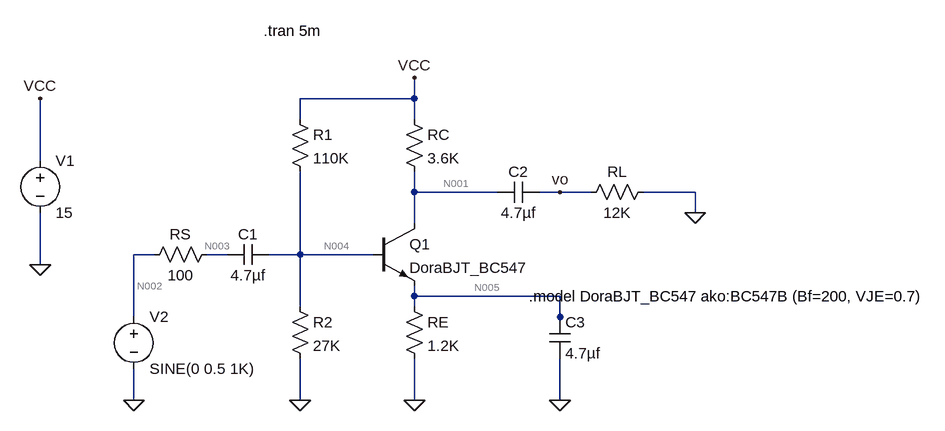
[diagram p0: schematic exp51a.asc]
exp51a.asc, the LTspice schematic file:
Version 4
SHEET 1 880 680
WIRE 32 -160 32 -192
WIRE 32 -160 -144 -160
WIRE -144 -128 -144 -160
WIRE 32 -128 32 -160
WIRE -544 -64 -544 -160
WIRE 32 -16 32 -48
WIRE 160 -16 32 -16
WIRE 256 -16 224 -16
WIRE 304 -16 256 -16
WIRE 464 -16 384 -16
WIRE 464 16 464 -16
WIRE 32 32 32 -16
WIRE -368 80 -400 80
WIRE -256 80 -288 80
WIRE -144 80 -144 -48
WIRE -144 80 -192 80
WIRE -32 80 -144 80
WIRE -544 96 -544 16
WIRE 32 144 32 128
WIRE 256 144 32 144
WIRE -144 160 -144 80
WIRE 32 160 32 144
WIRE -400 176 -400 80
WIRE 256 176 256 144
WIRE 256 192 256 176
WIRE -400 304 -400 256
WIRE -144 304 -144 240
WIRE 32 304 32 240
WIRE 256 304 256 240
FLAG -544 96 0
FLAG -544 -160 VCC
FLAG 32 -192 VCC
FLAG -144 304 0
FLAG 32 304 0
FLAG 464 16 0
FLAG -400 304 0
FLAG 256 -16 vo
FLAG 256 304 0
SYMBOL npn -32 32 R0
SYMATTR InstName Q1
SYMATTR Value DoraBJT_BC547
SYMBOL res 16 -144 R0
SYMATTR InstName RC
SYMATTR Value 3.6K
SYMBOL voltage -544 -80 R0
SYMATTR InstName V1
SYMATTR Value 15
SYMBOL res -160 -144 R0
SYMATTR InstName R1
SYMATTR Value 110K
SYMBOL res 16 144 R0
SYMATTR InstName RE
SYMATTR Value 1.2K
SYMBOL res -160 144 R0
SYMATTR InstName R2
SYMATTR Value 27K
SYMBOL res -272 64 R90
WINDOW 0 0 56 VBottom 2
WINDOW 3 32 56 VTop 2
SYMATTR InstName RS
SYMATTR Value 100
SYMBOL cap -192 64 R90
WINDOW 0 0 32 VBottom 2
WINDOW 3 32 32 VTop 2
SYMATTR InstName C1
SYMATTR Value 4.7µf
SYMBOL cap 224 -32 R90
WINDOW 0 0 32 VBottom 2
WINDOW 3 32 32 VTop 2
SYMATTR InstName C2
SYMATTR Value 4.7µf
SYMBOL res 400 -32 R90
WINDOW 0 0 56 VBottom 2
WINDOW 3 32 56 VTop 2
SYMATTR InstName RL
SYMATTR Value 12K
SYMBOL voltage -400 160 R0
WINDOW 123 0 0 Left 0
WINDOW 39 0 0 Left 0
SYMATTR InstName V2
SYMATTR Value SINE(0 0.5 1K)
SYMBOL cap 240 176 R0
SYMATTR InstName C3
SYMATTR Value 4.7µf
TEXT 208 144 Left 2 !.model DoraBJT_BC547 ako:BC547B (Bf=200, VJE=0.7)
TEXT -200 -264 Left 2 !.tran 5m

The netlist it stands for:
* exp51a.asc
Q1 N001 N004 N005 0 DoraBJT_BC547
RC VCC N001 3.6K
V1 VCC 0 15
R1 VCC N004 110K
RE N005 0 1.2K
R2 N004 0 27K
RS N003 N002 100
C1 N004 N003 4.7µf
C2 vo N001 4.7µf
RL 0 vo 12K
V2 N002 0 SINE(0 0.5 1K)
C3 N005 0 4.7µf
.model NPN NPN
.model PNP PNP
.lib standard.bjt
.model DoraBJT_BC547 ako:BC547B (Bf=200, VJE=0.7)
.tran 5m
.backanno
.end

* Results of the author's LTspice run, read from the files saved beside the schematic
* Operating Point, zero values left out:
*   V(n001) = 8.663 V
*   V(n004) = 2.774 V
*   V(n005) = 2.123 V
*   V(vcc) = 15 V
*   Ic(Q1) = 1.76 mA
*   Ib(Q1) = 8.385 µA
*   Ie(Q1) = -1.769 mA
*   I(R2) = 102.8 µA
*   I(Re) = 1.769 mA
*   I(R1) = 111.1 µA
*   I(Rc) = 1.76 mA
*   I(V1) = -1.872 mA
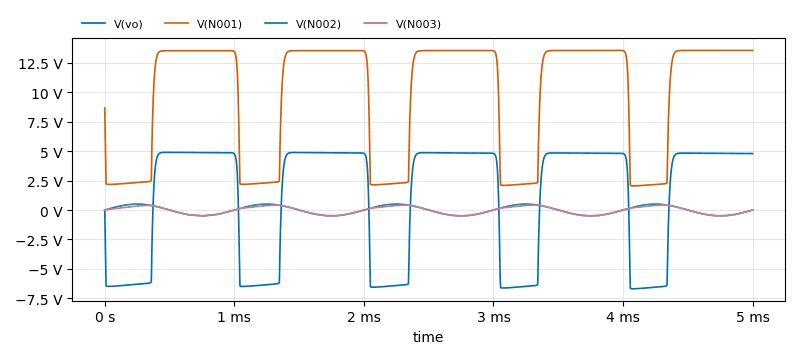
[diagram p1: Transient Analysis of exp51a.asc, plotted from the saved traces]
* Transient Analysis, 1 run:
*   V(vo): min -6.691 V, max 4.9 V, average 1.117 V, rms 5.298 V, last 4.787 V
*   V(N001): min 2.049 V, max 13.56 V, average 9.805 V, rms 11.09 V, last 13.55 V
*   V(N002): min -500 mV, max 500 mV, average 2.114 mV, rms 351.6 mV, last 0 V
*   V(N003): min -495.7 mV, max 422.5 mV, average -27.66 mV, rms 315.9 mV, last 2.306 mV